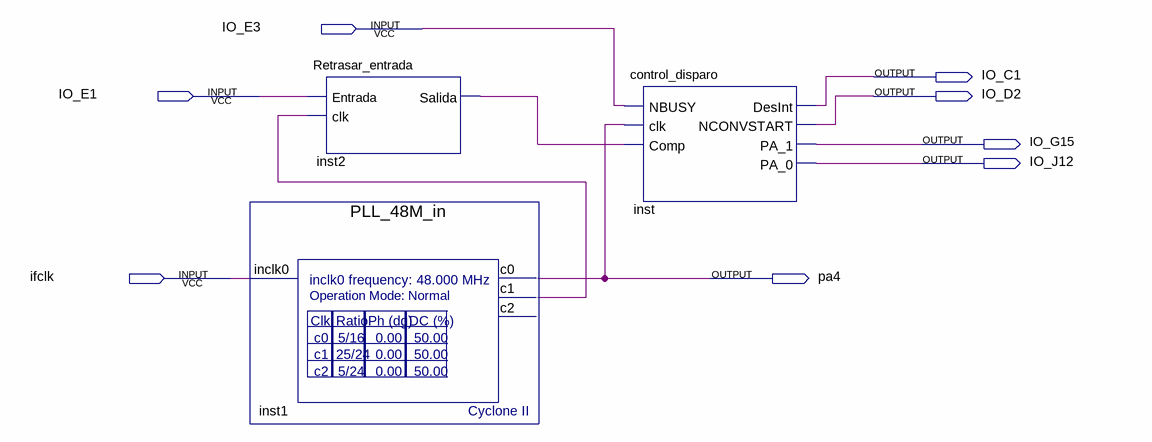
[diagram p0: schematic sheet]
// Quartus schematic Template.bdf as structural Verilog: 3 symbols, 8 pins
module Template (
  input  IO_E3,
  input  IO_E1,
  input  ifclk,
  output IO_C1,
  output IO_D2,
  output IO_G15,
  output IO_J12,
  output pa4
);

  wire inst1_c1, inst2_salida;

  PLL_48M_in inst1 (.inclk0(ifclk), .c0(pa4), .c1(inst1_c1));  // open: c2
  Retrasar_entrada inst2 (.Entrada(IO_E1), .clk(inst1_c1), .Salida(inst2_salida));
  control_disparo inst (
    .NBUSY(IO_E3), .clk(pa4), .Comp(inst2_salida), .DesInt(IO_C1), .NCONVSTART(IO_D2), .PA_1(IO_G15),
    .PA_0(IO_J12));
endmodule
